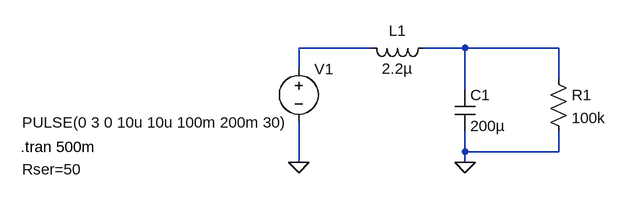
[diagram p0: schematic Inrush current.asc]
Inrush current.asc, the LTspice schematic file:
Version 4
SHEET 1 880 680
WIRE 32 64 -80 64
WIRE 176 64 112 64
WIRE 320 64 176 64
WIRE -80 96 -80 64
WIRE 320 112 320 64
WIRE 176 128 176 64
WIRE 176 224 176 192
WIRE 320 224 320 192
WIRE 320 224 176 224
WIRE -80 240 -80 176
WIRE 176 240 176 224
FLAG 176 240 0
FLAG -80 240 0
SYMBOL cap 160 128 R0
SYMATTR InstName C1
SYMATTR Value 200µ
SYMBOL voltage -80 80 R0
WINDOW 3 -426 99 Left 2
WINDOW 123 0 0 Left 0
WINDOW 39 -426 171 Left 2
SYMATTR InstName V1
SYMATTR Value PULSE(0 3 0 10u 10u 100m 200m 30)
SYMATTR SpiceLine Rser=50
SYMBOL ind 128 48 R90
WINDOW 0 5 56 VBottom 2
WINDOW 3 32 56 VTop 2
SYMATTR InstName L1
SYMATTR Value 2.2µ
SYMBOL res 304 96 R0
SYMATTR InstName R1
SYMATTR Value 100k
TEXT -508 216 Left 2 !.tran 500m

The netlist it stands for:
* Inrush current.asc
C1 N002 0 200µ
V1 N001 0 PULSE(0 3 0 10u 10u 100m 200m 30) Rser=50
L1 N002 N001 2.2µ
R1 N002 0 100k
.tran 500m
.backanno
.end